# EasyEDA schematic Artefato4Subtrator.json
TITLE: Sheet_1; REV: 1.0; Date: 2024-10-13; Sheet: 1/1; Drawn By: henriquebddantas; Company: Your Company
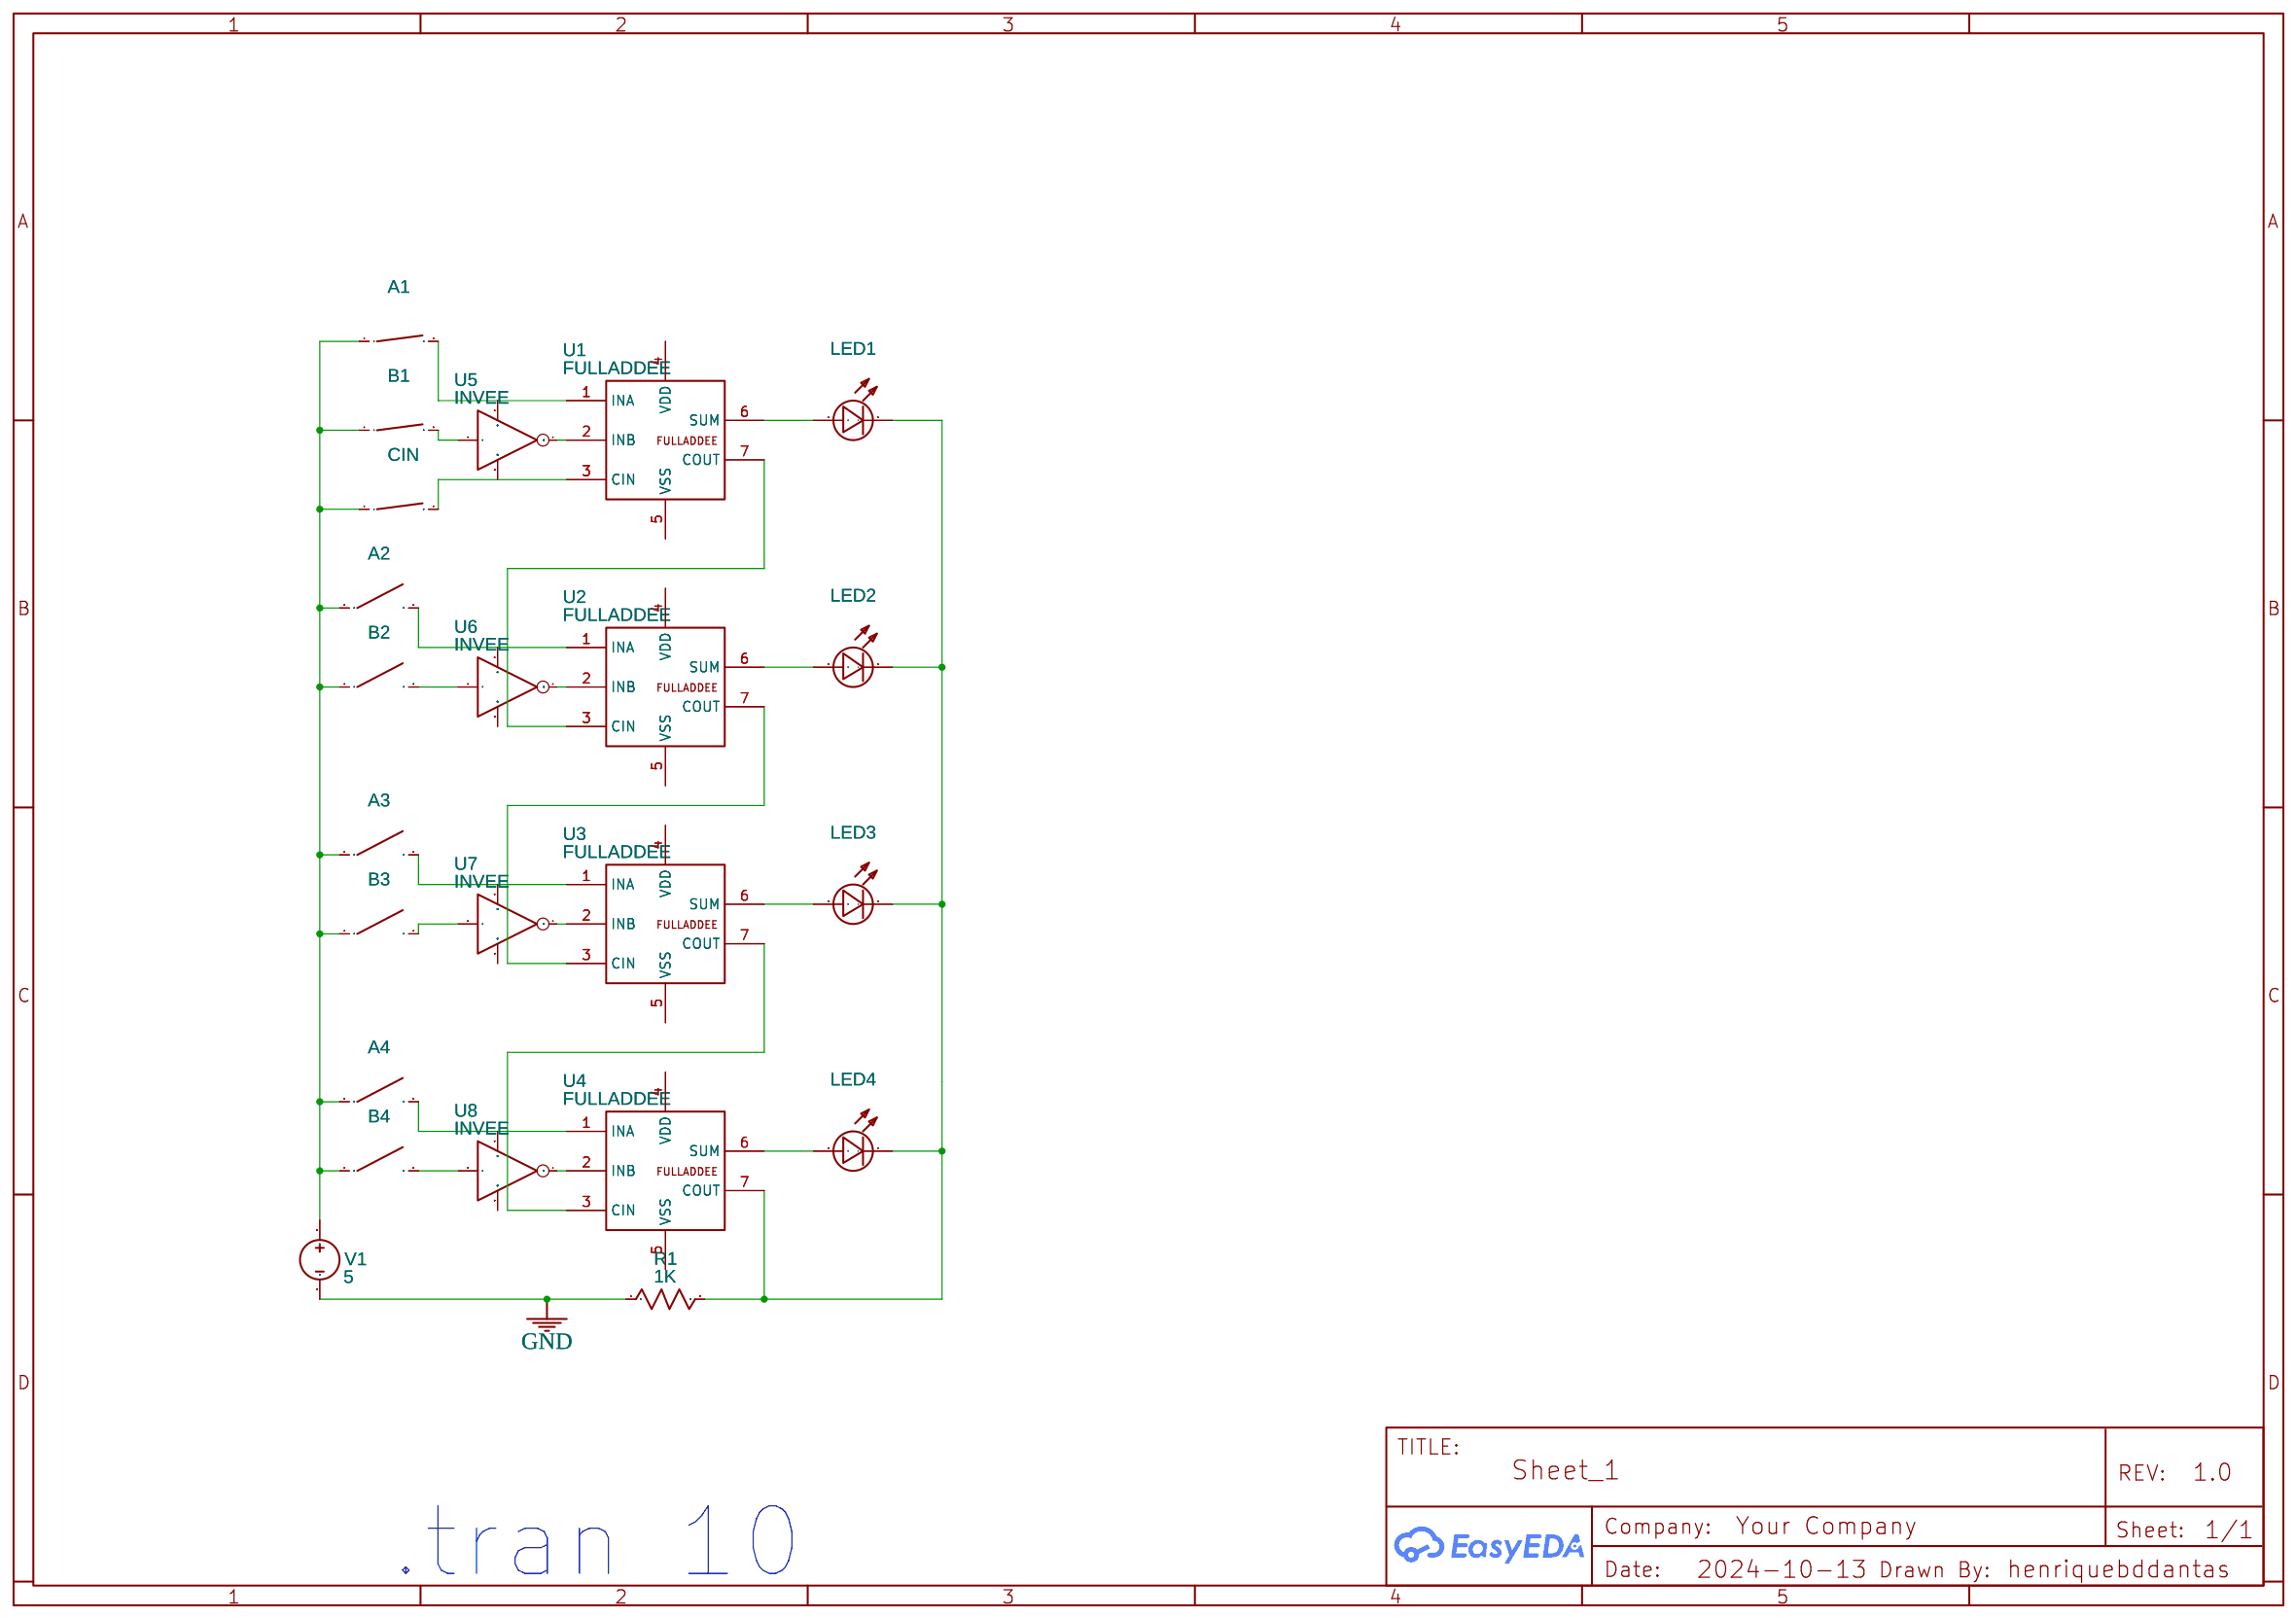
[diagram p0: schematic sheet]

## Parts
A1  SPST_Open
A2  SPST_Open
A3  SPST_Open
A4  SPST_Open
B1  SPST_Open
B2  SPST_Open
B3  SPST_Open
B4  SPST_Open
CIN  SPST_Open
LED1  LED
LED2  LED
LED3  LED
LED4  LED
R1  1K  [AXIAL-0.3]
U1  FULLADDEE
U2  FULLADDEE
U3  FULLADDEE
U4  FULLADDEE
U5  INVEE
U6  INVEE
U7  INVEE
U8  INVEE
V1  5  [HDR1X2]

## Library data of the parts
A1 B1 CIN = SPST: catid: 20; State: Close; Contributor: EasyEDA; NameDisplay: 0
A2-A4 B2-B4 = SPST: catid: 20; State: Open; Contributor: EasyEDA; NameDisplay: 0
LED1-LED4 = LED: catid: 20; Contributor: 仿真库绘制; Color: Red; NameDisplay: 0
R1 = Resistor_US: Resistance: 1k; Contributor: EasyEDA; Supplier: YUJING
U1-U4 = FULLADDEE: Contributor: example; link: https://oshwlab.com/andyfierman/how-to-use-logic-gates-and-devices-in-easyeda-part-1; sim: true
U5-U8 = LOGIC: Contributor: EasyEDA
V1 = VDC: Contributor: EasyEDA; sim: true

## Nets
GND: R1.1 V1.2
Net-(A1-1): A1.1 A2.1 A3.1 A4.1 B1.1 B2.1 B3.1 B4.1 CIN.1 V1.1
Net-(A1-2): A1.2 U1.1(INA)
Net-(A2-2): A2.2 U2.1(INA)
Net-(A3-2): A3.2 U3.1(INA)
Net-(A4-2): A4.2 U4.1(INA)
Net-(B1-2): B1.2 U5.1(IN)
Net-(B2-2): B2.2 U6.1(IN)
Net-(B3-2): B3.2 U7.1(IN)
Net-(B4-2): B4.2 U8.1(IN)
Net-(CIN-2): CIN.2 U1.3(CIN)
Net-(LED1-1): LED1.1(+) U1.6(SUM)
Net-(LED1-2): LED1.2(-) LED2.2(-) LED3.2(-) LED4.2(-) R1.2 U4.7(COUT)
Net-(LED2-1): LED2.1(+) U2.6(SUM)
Net-(LED3-1): LED3.1(+) U3.6(SUM)
Net-(LED4-1): LED4.1(+) U4.6(SUM)
Net-(U1-2): U1.2(INB) U5.4(OUT)
Net-(U1-7): U1.7(COUT) U2.3(CIN)
Net-(U2-2): U2.2(INB) U6.4(OUT)
Net-(U2-7): U2.7(COUT) U3.3(CIN)
Net-(U3-2): U3.2(INB) U7.4(OUT)
Net-(U3-7): U3.7(COUT) U4.3(CIN)
Net-(U4-2): U4.2(INB) U8.4(OUT)

Not connected (* = marked no-connect by the designer): U1 4(VDD) 5(VSS); U2 4(VDD) 5(VSS); U3 4(VDD) 5(VSS); U4 4(VDD) 5(VSS); U5 2(VDD) 3(GND); U6 2(VDD) 3(GND); U7 2(VDD) 3(GND); U8 2(VDD) 3(GND)

## Notes on the sheet
- .tran 10
